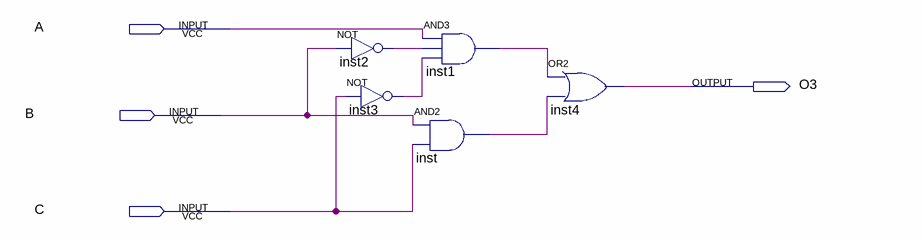
[diagram p0: schematic sheet]
// Quartus schematic F3.bdf as structural Verilog: 5 symbols, 4 pins
module F3 (
  input  A,
  input  B,
  input  C,
  output O3
);

  wire inst1_out, inst2_out, inst3_out, inst_out;

  not inst2 (inst2_out, B);
  not inst3 (inst3_out, C);
  and inst1 (inst1_out, A, inst2_out, inst3_out);
  and inst (inst_out, B, C);
  or inst4 (O3, inst1_out, inst_out);
endmodule
